# Altium schematic sheet Main.SchDoc
size A; SheetNumber: 3; SheetTotal: 5
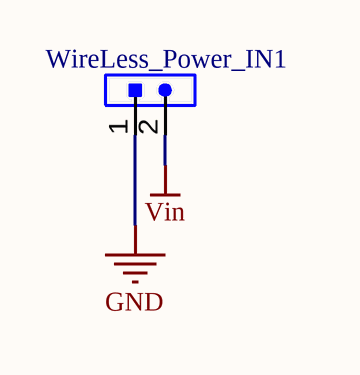
[diagram p0: Main.SchDoc]

## Parts
WireLess_Power_IN1  HDR-1X2  [XH2.54-2P]  (value not drawn)

## Nets
GND: WireLess_Power_IN1.1
Vin: WireLess_Power_IN1.2

## Library data of the parts
WireLess_Power_IN1 = Header 2: 2P Connector; BOM名称: 2P接插件; 版权归属: 源创客; 学习资源: www.ooocke.com